# Altium project STB_LightBoard.PrjPcb (part 5 of 10)

## Sheet LED_String_AREM-80C0.SchDoc: STB Light Board - 850nm String
size A4; Author: flmoll; DrawnBy: flmoll; Organization: PBL; Revision: A; SheetNumber: 14; SheetTotal: 20
Used 12 times, as channels LIR2/IR850_10, LIR2/IR850_11, LIR2/IR850_12, LIR2/IR850_13, LIR2/IR850_14, LIR2/IR850_15, LIR2/IR850_20, LIR2/IR850_21, LIR2/IR850_22, LIR2/IR850_23, LIR2/IR850_24, LIR2/IR850_25. Parts and nets are listed once, with the designators drawn on the sheet.
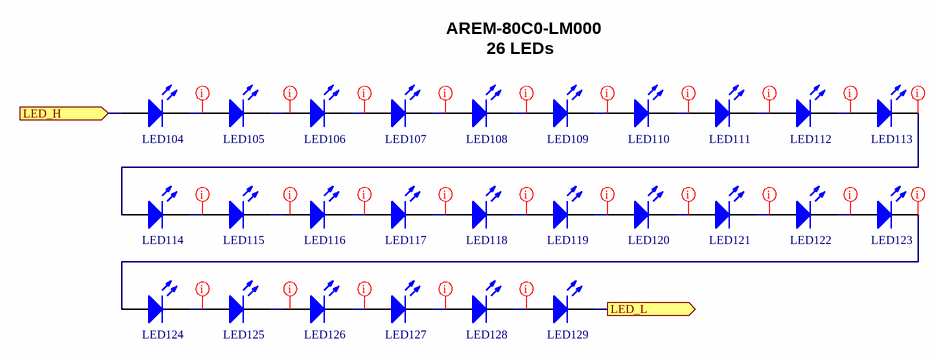
[diagram p9: LED_String_AREM-80C0.SchDoc]

### Parts
LED104  AREM-80C0-LM000  [AREM-80C0-LM000]  (value not drawn)
LED105  AREM-80C0-LM000  [AREM-80C0-LM000]  (value not drawn)
LED106  AREM-80C0-LM000  [AREM-80C0-LM000]  (value not drawn)
LED107  AREM-80C0-LM000  [AREM-80C0-LM000]  (value not drawn)
LED108  AREM-80C0-LM000  [AREM-80C0-LM000]  (value not drawn)
LED109  AREM-80C0-LM000  [AREM-80C0-LM000]  (value not drawn)
LED110  AREM-80C0-LM000  [AREM-80C0-LM000]  (value not drawn)
LED111  AREM-80C0-LM000  [AREM-80C0-LM000]  (value not drawn)
LED112  AREM-80C0-LM000  [AREM-80C0-LM000]  (value not drawn)
LED113  AREM-80C0-LM000  [AREM-80C0-LM000]  (value not drawn)
LED114  AREM-80C0-LM000  [AREM-80C0-LM000]  (value not drawn)
LED115  AREM-80C0-LM000  [AREM-80C0-LM000]  (value not drawn)
LED116  AREM-80C0-LM000  [AREM-80C0-LM000]  (value not drawn)
LED117  AREM-80C0-LM000  [AREM-80C0-LM000]  (value not drawn)
LED118  AREM-80C0-LM000  [AREM-80C0-LM000]  (value not drawn)
LED119  AREM-80C0-LM000  [AREM-80C0-LM000]  (value not drawn)
LED120  AREM-80C0-LM000  [AREM-80C0-LM000]  (value not drawn)
LED121  AREM-80C0-LM000  [AREM-80C0-LM000]  (value not drawn)
LED122  AREM-80C0-LM000  [AREM-80C0-LM000]  (value not drawn)
LED123  AREM-80C0-LM000  [AREM-80C0-LM000]  (value not drawn)
LED124  AREM-80C0-LM000  [AREM-80C0-LM000]  (value not drawn)
LED125  AREM-80C0-LM000  [AREM-80C0-LM000]  (value not drawn)
LED126  AREM-80C0-LM000  [AREM-80C0-LM000]  (value not drawn)
LED127  AREM-80C0-LM000  [AREM-80C0-LM000]  (value not drawn)
LED128  AREM-80C0-LM000  [AREM-80C0-LM000]  (value not drawn)
LED129  AREM-80C0-LM000  [AREM-80C0-LM000]  (value not drawn)

### Ports
LED_H (in, see LED_Driver_AREM-80C0[2B]), LED_L (out, see LED_Driver_AREM-80C0[2B])

### Nets
LED_H: LED104.2(A) ; port LED_H
LED_L: LED129.1(K) ; port LED_L
NetLED104_1: LED104.1(K) LED105.2(A)
NetLED105_1: LED105.1(K) LED106.2(A)
NetLED106_1: LED106.1(K) LED107.2(A)
NetLED107_1: LED107.1(K) LED108.2(A)
NetLED108_1: LED108.1(K) LED109.2(A)
NetLED109_1: LED109.1(K) LED110.2(A)
NetLED110_1: LED110.1(K) LED111.2(A)
NetLED111_1: LED111.1(K) LED112.2(A)
NetLED112_1: LED112.1(K) LED113.2(A)
NetLED113_1: LED113.1(K) LED114.2(A)
NetLED114_1: LED114.1(K) LED115.2(A)
NetLED115_1: LED115.1(K) LED116.2(A)
NetLED116_1: LED116.1(K) LED117.2(A)
NetLED117_1: LED117.1(K) LED118.2(A)
NetLED118_1: LED118.1(K) LED119.2(A)
NetLED119_1: LED119.1(K) LED120.2(A)
NetLED120_1: LED120.1(K) LED121.2(A)
NetLED121_1: LED121.1(K) LED122.2(A)
NetLED122_1: LED122.1(K) LED123.2(A)
NetLED123_1: LED123.1(K) LED124.2(A)
NetLED124_1: LED124.1(K) LED125.2(A)
NetLED125_1: LED125.1(K) LED126.2(A)
NetLED126_1: LED126.1(K) LED127.2(A)
NetLED127_1: LED127.1(K) LED128.2(A)
NetLED128_1: LED128.1(K) LED129.2(A)

### Channels
LIR2/IR850_10: designators end in _IR850_10; ports LED_H=NetC7_D19_2 LED_L=NetLED129_IR850_10_1
LIR2/IR850_11: designators end in _IR850_11; ports LED_H=NetC7_D19_2 LED_L=NetLED129_IR850_11_1
LIR2/IR850_12: designators end in _IR850_12; ports LED_H=NetC7_D19_2 LED_L=NetLED129_IR850_12_1
LIR2/IR850_13: designators end in _IR850_13; ports LED_H=NetC7_D19_2 LED_L=NetLED129_IR850_13_1
LIR2/IR850_14: designators end in _IR850_14; ports LED_H=NetC7_D19_2 LED_L=NetLED129_IR850_14_1
LIR2/IR850_15: designators end in _IR850_15; ports LED_H=NetC7_D19_2 LED_L=NetLED129_IR850_15_1
LIR2/IR850_20: designators end in _IR850_20; ports LED_H=NetC7_D20_2 LED_L=NetLED129_IR850_20_1
LIR2/IR850_21: designators end in _IR850_21; ports LED_H=NetC7_D20_2 LED_L=NetLED129_IR850_21_1
LIR2/IR850_22: designators end in _IR850_22; ports LED_H=NetC7_D20_2 LED_L=NetLED129_IR850_22_1
LIR2/IR850_23: designators end in _IR850_23; ports LED_H=NetC7_D20_2 LED_L=NetLED129_IR850_23_1
LIR2/IR850_24: designators end in _IR850_24; ports LED_H=NetC7_D20_2 LED_L=NetLED129_IR850_24_1
LIR2/IR850_25: designators end in _IR850_25; ports LED_H=NetC7_D20_2 LED_L=NetLED129_IR850_25_1

### Layout directives
net class LED: (no net found under the mark), NetLED104_IR850_10_1, NetLED106_IR850_10_1, NetLED107_IR850_10_1, NetLED108_IR850_10_1, NetLED109_IR850_10_1, NetLED110_IR850_10_1, NetLED111_IR850_10_1, NetLED112_IR850_10_1, NetLED113_IR850_10_1, NetLED114_IR850_10_1, NetLED116_IR850_10_1, NetLED117_IR850_10_1, NetLED118_IR850_10_1, NetLED119_IR850_10_1, NetLED120_IR850_10_1, NetLED121_IR850_10_1, NetLED122_IR850_10_1, NetLED123_IR850_10_1, NetLED124_IR850_10_1, NetLED126_IR850_10_1, NetLED127_IR850_10_1, NetLED128_IR850_10_1

### Notes on the sheet
- AREM-80C0-LM000
- 26 LEDs
- 1
- 2
- 3
- 4
- A
- B
- C
- Project:
- D
- Date:
- Drawing number:
- Rev:
- Format:
- A4 Q
- Drawn by:
- Laboratory:
- Page
- Sheet:
- of
- File:

### Library data of the parts
LED104-LED129 = CMP-02056-1: Infrared (IR) Emitter 850nm 1.5V 70mA 14.4mW/sr @ 70mA (Typ) 120° 2-PLCC; Mfr: Broadcom Limited; Manufacturer: Broadcom; Base Product Number: AREM; Series: AREM-80C0-xx000; Type: Infrared (IR); Current - DC Forward (If) (Max): 70mA; Radiant Intensity (Ie) Min @ If: 14.4mW/sr @ 70mA (Typ); Wavelength: 850nm; Voltage - Forward (Vf) (Typ): 1.5V; Viewing Angle: 120°; Orientation: Top View; Operating Temperature: -40°C ~ 100°C; Mounting Type: Surface Mount; Package / Case: 2-PLCC; Supplier 1: Digi-Key; Supplier Part Number 1: 516-AREM-80C0-LM000DKR-ND; Manufacturer Part Number: AREM-80C0-LM000; RoHS: No; Stock 1: 49823; Pricing 1: 1=0.62000, 10=0.40500, 100=0.26800, 1000=0.20689 (USD)

## Sheet LED_Driver_AREM-90C0.SchDoc: STB Light Board - 940nm
size A3; Author: mayerph; DrawnBy: mayerph; Organization: PBL; Revision: A; SheetNumber: 15; SheetTotal: 20
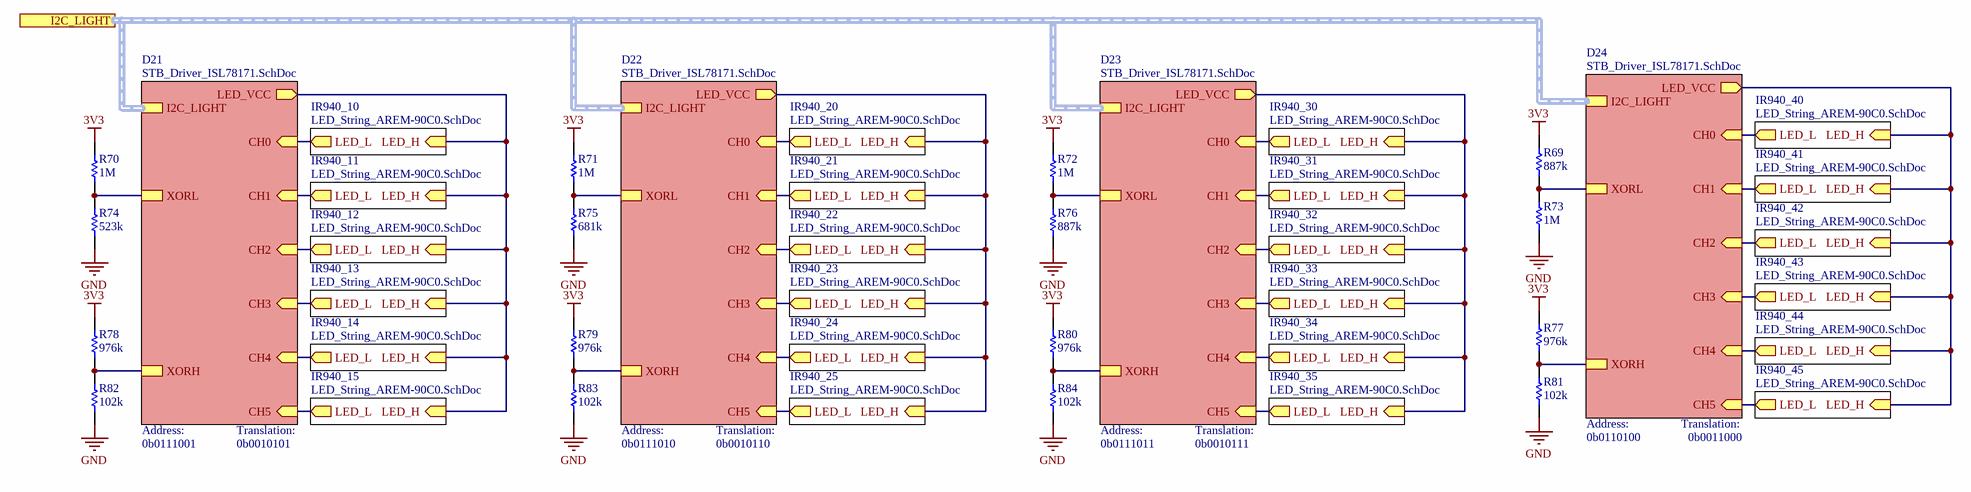
[diagram p10: LED_Driver_AREM-90C0.SchDoc]

### Parts
R69  887k  [RESC1005X40X25LL05T10]
R70  1M  [RESC1005X40X25LL05T05]
R71  1M  [RESC1005X40X25LL05T05]
R72  1M  [RESC1005X40X25LL05T05]
R73  1M  [RESC1005X40X25LL05T05]
R74  523k  [RESC1005X40X25LL05T05]
R75  681k  [RESC1005X40X25LL05T05]
R76  887k  [RESC1005X40X25LL05T10]
R77  976k  [RESC1005X40X25LL05T05]
R78  976k  [RESC1005X40X25LL05T05]
R79  976k  [RESC1005X40X25LL05T05]
R80  976k  [RESC1005X40X25LL05T05]
R81  102k  [RESC1005X40X25LL05T05]
R82  102k  [RESC1005X40X25LL05T05]
R83  102k  [RESC1005X40X25LL05T05]
R84  102k  [RESC1005X40X25LL05T05]

### Sub-sheets
D21 = STB_Driver_ISL78171.SchDoc: CH0 (in), XORL, XORH, LED_VCC (out), CH1 (in), CH2 (in), CH3 (in), CH4 (in), CH5 (in), I2C_LIGHT (harness I2C_LIGHT)
D22 = STB_Driver_ISL78171.SchDoc: CH0 (in), XORL, XORH, LED_VCC (out), CH1 (in), CH2 (in), CH3 (in), CH4 (in), CH5 (in), I2C_LIGHT (harness I2C_LIGHT)
D23 = STB_Driver_ISL78171.SchDoc: CH0 (in), XORL, XORH, LED_VCC (out), CH1 (in), CH2 (in), CH3 (in), CH4 (in), CH5 (in), I2C_LIGHT (harness I2C_LIGHT)
D24 = STB_Driver_ISL78171.SchDoc: CH0 (in), XORL, XORH, LED_VCC (out), CH1 (in), CH2 (in), CH3 (in), CH4 (in), CH5 (in), I2C_LIGHT (harness I2C_LIGHT)
IR940_10 = LED_String_AREM-90C0.SchDoc: LED_H (in), LED_L (out)
IR940_11 = LED_String_AREM-90C0.SchDoc: LED_H (in), LED_L (out)
IR940_12 = LED_String_AREM-90C0.SchDoc: LED_H (in), LED_L (out)
IR940_13 = LED_String_AREM-90C0.SchDoc: LED_H (in), LED_L (out)
IR940_14 = LED_String_AREM-90C0.SchDoc: LED_H (in), LED_L (out)
IR940_15 = LED_String_AREM-90C0.SchDoc: LED_H (in), LED_L (out)
IR940_20 = LED_String_AREM-90C0.SchDoc: LED_H (in), LED_L (out)
IR940_21 = LED_String_AREM-90C0.SchDoc: LED_H (in), LED_L (out)
IR940_22 = LED_String_AREM-90C0.SchDoc: LED_H (in), LED_L (out)
IR940_23 = LED_String_AREM-90C0.SchDoc: LED_H (in), LED_L (out)
IR940_24 = LED_String_AREM-90C0.SchDoc: LED_H (in), LED_L (out)
IR940_25 = LED_String_AREM-90C0.SchDoc: LED_H (in), LED_L (out)
IR940_30 = LED_String_AREM-90C0.SchDoc: LED_H (in), LED_L (out)
IR940_31 = LED_String_AREM-90C0.SchDoc: LED_H (in), LED_L (out)
IR940_32 = LED_String_AREM-90C0.SchDoc: LED_H (in), LED_L (out)
IR940_33 = LED_String_AREM-90C0.SchDoc: LED_H (in), LED_L (out)
IR940_34 = LED_String_AREM-90C0.SchDoc: LED_H (in), LED_L (out)
IR940_35 = LED_String_AREM-90C0.SchDoc: LED_H (in), LED_L (out)
IR940_40 = LED_String_AREM-90C0.SchDoc: LED_H (in), LED_L (out)
IR940_41 = LED_String_AREM-90C0.SchDoc: LED_H (in), LED_L (out)
IR940_42 = LED_String_AREM-90C0.SchDoc: LED_H (in), LED_L (out)
IR940_43 = LED_String_AREM-90C0.SchDoc: LED_H (in), LED_L (out)
IR940_44 = LED_String_AREM-90C0.SchDoc: LED_H (in), LED_L (out)
IR940_45 = LED_String_AREM-90C0.SchDoc: LED_H (in), LED_L (out)

### Ports
I2C_LIGHT (harness I2C_LIGHT, see STB_LightBoard[4C], LED_Driver_AREM-80C0[1A], LED_Driver_NE2B757GT[2B], LED_Driver_NE2G757GT[2B], LED_Driver_NE2R757GT-P6[2B], LED_Driver_NF2L757GT-F1[1A], LED_Driver_NF2W757GT-F1[1A], LED_Driver_QBHP686[1A], STB_Driver_ISL78171[1A], STB_FanControl[1A], STB_UID[1A])

### Nets
3V3: R69.2 R70.2 R71.2 R72.2 R77.2 R78.2 R79.2 R80.2
GND: R73.1 R74.1 R75.1 R76.1 R81.1 R82.1 R83.1 R84.1
NetC7_D21_2: sheet D21/LED_VCC, sheet IR940_10/LED_H, sheet IR940_11/LED_H, sheet IR940_12/LED_H, sheet IR940_13/LED_H, sheet IR940_14/LED_H, sheet IR940_15/LED_H
NetC7_D22_2: sheet D22/LED_VCC, sheet IR940_20/LED_H, sheet IR940_21/LED_H, sheet IR940_22/LED_H, sheet IR940_23/LED_H, sheet IR940_24/LED_H, sheet IR940_25/LED_H
NetC7_D23_2: sheet D23/LED_VCC, sheet IR940_30/LED_H, sheet IR940_31/LED_H, sheet IR940_32/LED_H, sheet IR940_33/LED_H, sheet IR940_34/LED_H, sheet IR940_35/LED_H
NetC7_D24_2: sheet D24/LED_VCC, sheet IR940_40/LED_H, sheet IR940_41/LED_H, sheet IR940_42/LED_H, sheet IR940_43/LED_H, sheet IR940_44/LED_H, sheet IR940_45/LED_H
NetLED41_IR940_10_1: sheet D21/CH0, sheet IR940_10/LED_L
NetLED41_IR940_11_1: sheet D21/CH1, sheet IR940_11/LED_L
NetLED41_IR940_12_1: sheet D21/CH2, sheet IR940_12/LED_L
NetLED41_IR940_13_1: sheet D21/CH3, sheet IR940_13/LED_L
NetLED41_IR940_14_1: sheet D21/CH4, sheet IR940_14/LED_L
NetLED41_IR940_15_1: sheet D21/CH5, sheet IR940_15/LED_L
NetLED41_IR940_20_1: sheet D22/CH0, sheet IR940_20/LED_L
NetLED41_IR940_21_1: sheet D22/CH1, sheet IR940_21/LED_L
NetLED41_IR940_22_1: sheet D22/CH2, sheet IR940_22/LED_L
NetLED41_IR940_23_1: sheet D22/CH3, sheet IR940_23/LED_L
NetLED41_IR940_24_1: sheet D22/CH4, sheet IR940_24/LED_L
NetLED41_IR940_25_1: sheet D22/CH5, sheet IR940_25/LED_L
NetLED41_IR940_30_1: sheet D23/CH0, sheet IR940_30/LED_L
NetLED41_IR940_31_1: sheet D23/CH1, sheet IR940_31/LED_L
NetLED41_IR940_32_1: sheet D23/CH2, sheet IR940_32/LED_L
NetLED41_IR940_33_1: sheet D23/CH3, sheet IR940_33/LED_L
NetLED41_IR940_34_1: sheet D23/CH4, sheet IR940_34/LED_L
NetLED41_IR940_35_1: sheet D23/CH5, sheet IR940_35/LED_L
NetLED41_IR940_40_1: sheet D24/CH0, sheet IR940_40/LED_L
NetLED41_IR940_41_1: sheet D24/CH1, sheet IR940_41/LED_L
NetLED41_IR940_42_1: sheet D24/CH2, sheet IR940_42/LED_L
NetLED41_IR940_43_1: sheet D24/CH3, sheet IR940_43/LED_L
NetLED41_IR940_44_1: sheet D24/CH4, sheet IR940_44/LED_L
NetLED41_IR940_45_1: sheet D24/CH5, sheet IR940_45/LED_L
NetR69_1: R69.1 R73.2 ; sheet D24/XORL
NetR70_1: R70.1 R74.2 ; sheet D21/XORL
NetR71_1: R71.1 R75.2 ; sheet D22/XORL
NetR72_1: R72.1 R76.2 ; sheet D23/XORL
NetR77_1: R77.1 R81.2 ; sheet D24/XORH
NetR78_1: R78.1 R82.2 ; sheet D21/XORH
NetR79_1: R79.1 R83.2 ; sheet D22/XORH
NetR80_1: R80.1 R84.2 ; sheet D23/XORH

### Buses and harness runs
harness port I2C_LIGHT = sheet D21/I2C_LIGHT = sheet D22/I2C_LIGHT = sheet D23/I2C_LIGHT = sheet D24/I2C_LIGHT

### Notes on the sheet
- (near R82) Address:
- 0b0111001
- Translation:
- 0b0010101
- (near R83) Address:
- 0b0111010
- 0b0010110
- (near R84) Address:
- 0b0111011
- 0b0010111
- (near R81) Address:
- 0b0110100
- 0b0011000
- 1
- 2
- 3
- 4
- 5
- 6
- 7
- 8
- A
- B
- C
- D
- Project:
- Date:
- Drawing number:
- Rev:
- Format:
- A3
- Drawn by:
- Laboratory:
- Page
- Sheet:
- of
- File:

### Library data of the parts
R69 R76 = CMP-2002-07827-1: Part Number: RC0402FR-07887KL; Manufacturer: Yageo / Phycomp; Tolerance: 1%; Rated Power Dissipation (P): 62.5mW; Rated Temperature: 70°C; Value: 887 kOhm; Temperature Coefficient: 100ppm/°C; Working Voltage: 50V; Additional Feature: LASER TRIMMABLE; Package Height: 0.35mm; Package Length: 1mm; Package Width: 0.5mm; Supplier 1: Digi-Key; Supplier Part Number 1: YAG3251CT-ND; Manufacturer Part Number: RC0402FR-07887KL; RoHS: Yes; Category: Chip SMD Resistors; Stock 1: 288491; Pricing 1: 1=0.10000, 10=0.01500, 100=0.00600, 1000=0.00267, 2500=0.00232, 5000=0.00192 (USD); Mount: Surface Mount; Number of Pins: 2; Size Code: 0402; Terminal Finish: Nickel; Package Shape: Rectangular; Min Operating Temperature: -55°C; Max Operating Temperature: 155°C; Resistor Type: FIXED RESISTOR; Construction: Chip; Package Style: SMTMeter; Packaging: Tape and Reel; Termination: Wraparound; JESD-609 Code: e3; Technology: METAL GLAZE/THICK FILM; Reach SVHC Compliant: Yes; RoHS Compliant: Yes; ComponentLink1URL: https://datasheet.ciiva.com:443/pdfs/VipMasterIC/IC/YAGO/YAGO-S-A0008145938/YAGO-S-A0008145938-1.pdf?src-supplier=IHS+Markit; ComponentLink1Description: https://datasheet.ciiva.com:443/pdfs/VipMasterIC/IC/YAGO/YAGO-S-A0008145938/YAGO-S-A0008145938-1.pdf?src-supplier=IHS+Markit; ComponentLink2URL: https://datasheet.ciiva.com/16744/pyu-rc0402-51-rohs-l-6-r-16744239.pdf?src-supplier=Future+Electronics; ComponentLink2Description: https://datasheet.ciiva.com/16744/pyu-rc0402-51-rohs-l-6-r-16744239.pdf?src-supplier=Future+Electronics
R70-R73 = CMP-2002-00609-3: Chip Resistor, 1 MOhm, +/- 1%, 100 mW, -55 to 155 degC, 0402 (1005 Metric), RoHS, Tape and Reel; PartNumber: ERJ-2RKF1004X; Manufacturer: Basic Passives; Voltage Rating: 50 V; Case\/Package: 0402; Value: 1 MOhm; Power Rating: 100 mW; Rated Power Dissipation (P): 100mW; Temperature Coefficient: 100ppm/°C; Working Voltage: 50V; Rated Temperature: 70°C; Package Height: 0.35mm; Package Length: 1mm; Package Width: 0.5mm; Reference Standard: AEC-Q200; Pins: 2; Max Operating Temperature: 155 degC; ComponentLink2URL: http://industrial.panasonic.com/cdbs/www-data/pdf/RDA0000/AOA0000C86.pdf; Weight: 2.8E-05oz; ComponentLink1URL: http://www.panasonic.com/; Radiation Hardening: No; Height: 0.35 mm; Case Code (Imperial): 0402; ComponentLink2Description: Datasheet; Mount: Surface Mount; ComponentLink1Description: Manufacturer URL; REACH SVHC: Yes; Length: 1 mm; Min Operating Temperature: -55 degC; Width: 0.5 mm; Package Quantity: 10000; Tolerance: 1%; PackageDescription: 2-Pin Surface Mount Device, Body 1 x 0.5 mm; RoHSCompliant: true; DatasheetVersion: 04/2015; PackageReference: 0402; Mounting Technology: Surface Mount; Case Code (Metric): 1005; Packaging: Tape and Reel; Supplier 1: Digi-Key; Supplier Part Number 1: P1.00MLDKR-ND; Manufacturer Part Number: ERJ-2RKF1004X; RoHS: Yes; Category: Chip SMD Resistors; Stock 1: 1012879; Pricing 1: 1=0.10000, 10=0.03300, 100=0.01330, 1000=0.00599, 2500=0.00520, 5000=0.00429 (USD); Number of Pins: 2; Package Shape: Rectangular; Size Code: 0402; Terminal Finish: Nickel; JESD-609 Code: e3; Resistor Type: FIXED RESISTOR; Construction: Rectangular; Package Style: SMTMeter; Technology: METAL GLAZE/THICK FILM; Termination: Wraparound; Reach SVHC Compliant: Yes; RoHS Compliant: Yes; ComponentLink3URL: https://datasheet.ciiva.com:443/pdfs/VipMasterIC/IC/PANA/PANA-S-A0009889626/PANA-S-A0009889626-1.pdf?src-supplier=IHS+Markit; ComponentLink3Description: https://datasheet.ciiva.com:443/pdfs/VipMasterIC/IC/PANA/PANA-S-A0009889626/PANA-S-A0009889626-1.pdf?src-supplier=IHS+Markit; ComponentLink4URL: https://datasheet.ciiva.com/34303/1987046-34303551.pdf?src-supplier=Jameco; ComponentLink4Description: https://datasheet.ciiva.com/34303/1987046-34303551.pdf?src-supplier=Jameco; ComponentLink5URL: https://datasheet.ciiva.com/11821/0900766b80f80784-11821229.pdf?src-supplier=RSComponents; ComponentLink5Description: https://datasheet.ciiva.com/11821/0900766b80f80784-11821229.pdf?src-supplier=RSComponents; ComponentLink6URL: https://datasheet.ciiva.com/7909/aoa0000ce2-7909180.pdf?src-supplier=Element14; ComponentLink6Description: https://datasheet.ciiva.com/7909/aoa0000ce2-7909180.pdf?src-supplier=Element14; ComponentLink7URL: https://datasheet.ciiva.com/22723/1678782-22723164.pdf?src-supplier=Element14; ComponentLink7Description: https://datasheet.ciiva.com/22723/1678782-22723164.pdf?src-supplier=Element14; ComponentLink8URL: https://datasheet.ciiva.com/24158/aoa0000ce2-24158990.pdf?src-supplier=Mouser; ComponentLink8Description: https://datasheet.ciiva.com/24158/aoa0000ce2-24158990.pdf?src-supplier=Mouser; ComponentLink9URL: https://datasheet.ciiva.com/16766/70260748-16766711.pdf?src-supplier=Allied+Electronics; ComponentLink9Description: https://datasheet.ciiva.com/16766/70260748-16766711.pdf?src-supplier=Allied+Electronics; ComponentLink10URL: https://datasheet.ciiva.com/16779/70260748-16779288.pdf?src-supplier=Allied+Electronics; ComponentLink10Description: https://datasheet.ciiva.com/16779/70260748-16779288.pdf?src-supplier=Allied+Electronics; ComponentLink11URL: https://datasheet.ciiva.com/16199/aoa0000ce2-16199544.pdf?src-supplier=Future+Electronics; ComponentLink11Description: https://datasheet.ciiva.com/16199/aoa0000ce2-16199544.pdf?src-supplier=Future+Electronics
R74 = CMP-2002-00982-1: Manufacturer: Panasonic; Part Number: ERJ-2RKF5233X; Tolerance: 1%; Rated Power Dissipation (P): 100mW; Value: 523 kOhm; Temperature Coefficient: 100ppm/°C; Working Voltage: 50V; Rated Temperature: 70°C; Package Height: 0.35mm; Package Length: 1mm; Package Width: 0.5mm; Reference Standard: AEC-Q200; Supplier 1: Digi-Key; Supplier Part Number 1: P523KLCT-ND; Manufacturer Part Number: ERJ-2RKF5233X; RoHS: Yes; Category: Chip SMD Resistors; Stock 1: 154886; Pricing 1: 1=0.10000, 10=0.03300, 100=0.01330, 1000=0.00599, 2500=0.00520, 5000=0.00429 (USD); Mount: Surface Mount; Number of Pins: 2; Size Code: 0402; Terminal Finish: Nickel; Package Shape: Rectangular; Min Operating Temperature: -55°C; Max Operating Temperature: 155°C; JESD-609 Code: e3; Resistor Type: FIXED RESISTOR; Construction: Rectangular; Package Style: SMTMeter; Packaging: Tape and Reel; Technology: METAL GLAZE/THICK FILM; Termination: Wraparound; Reach SVHC Compliant: Yes; RoHS Compliant: Yes; ComponentLink1URL: https://datasheet.ciiva.com:443/pdfs/VipMasterIC/IC/PANA/PANA-S-A0009889626/PANA-S-A0009889626-1.pdf?src-supplier=IHS+Markit; ComponentLink1Description: https://datasheet.ciiva.com:443/pdfs/VipMasterIC/IC/PANA/PANA-S-A0009889626/PANA-S-A0009889626-1.pdf?src-supplier=IHS+Markit; ComponentLink2URL: https://datasheet.ciiva.com/30220/aoa0000ce2-30220984.pdf?src-supplier=Onlinecomponents.com; ComponentLink2Description: https://datasheet.ciiva.com/30220/aoa0000ce2-30220984.pdf?src-supplier=Onlinecomponents.com; ComponentLink3URL: https://datasheet.ciiva.com/24027/aoa0000ce2-24027141.pdf?src-supplier=Mouser; ComponentLink3Description: https://datasheet.ciiva.com/24027/aoa0000ce2-24027141.pdf?src-supplier=Mouser; ComponentLink4URL: https://datasheet.ciiva.com/9181/aoa0000ce2-9181337.pdf?src-supplier=Avnet; ComponentLink4Description: https://datasheet.ciiva.com/9181/aoa0000ce2-9181337.pdf?src-supplier=Avnet; ComponentLink5URL: https://datasheet.ciiva.com/9181/aoa0000ce2-9181340.pdf?src-supplier=Avnet; ComponentLink5Description: https://datasheet.ciiva.com/9181/aoa0000ce2-9181340.pdf?src-supplier=Avnet; ComponentLink6URL: https://datasheet.ciiva.com/22668/1678782-22668381.pdf?src-supplier=Element14; ComponentLink6Description: https://datasheet.ciiva.com/22668/1678782-22668381.pdf?src-supplier=Element14; ComponentLink7URL: https://datasheet.ciiva.com/43467/1678782-43467550.pdf?src-supplier=Farnell; ComponentLink7Description: https://datasheet.ciiva.com/43467/1678782-43467550.pdf?src-supplier=Farnell; ComponentLink8URL: https://datasheet.ciiva.com/46372/1678782-46372943.pdf?src-supplier=Element14; ComponentLink8Description: https://datasheet.ciiva.com/46372/1678782-46372943.pdf?src-supplier=Element14
R75 = CMP-2002-01040-1: Manufacturer: Panasonic; Part Number: ERJ-2RKF6813X; Tolerance: 1%; Rated Power Dissipation (P): 100mW; Rated Temperature: 70°C; Value: 681 kOhm; Temperature Coefficient: 100ppm/°C; Working Voltage: 50V; Package Height: 0.35mm; Package Length: 1mm; Package Width: 0.5mm; Reference Standard: AEC-Q200; Supplier 1: Digi-Key; Supplier Part Number 1: P681KLCT-ND; Manufacturer Part Number: ERJ-2RKF6813X; RoHS: Yes; Category: Chip SMD Resistors; Stock 1: 3837; Pricing 1: 1=0.10000, 10=0.03300, 100=0.01330, 1000=0.00599, 2500=0.00520, 5000=0.00429 (USD); Mount: Surface Mount; Number of Pins: 2; Size Code: 0402; Terminal Finish: Nickel; Package Shape: Rectangular; Min Operating Temperature: -55°C; Max Operating Temperature: 155°C; Resistor Type: FIXED RESISTOR; Packaging: Tape and Reel; Termination: Wraparound; Construction: Rectangular; Package Style: SMTMeter; Technology: METAL GLAZE/THICK FILM; JESD-609 Code: e3; Reach SVHC Compliant: Yes; RoHS Compliant: Yes; ComponentLink1URL: https://datasheet.ciiva.com:443/pdfs/VipMasterIC/IC/PANA/PANA-S-A0009889626/PANA-S-A0009889626-1.pdf?src-supplier=IHS+Markit; ComponentLink1Description: https://datasheet.ciiva.com:443/pdfs/VipMasterIC/IC/PANA/PANA-S-A0009889626/PANA-S-A0009889626-1.pdf?src-supplier=IHS+Markit; ComponentLink2URL: https://datasheet.ciiva.com/3883/3984280s8821682n1386-3883650.pdf?src-supplier=Arrow+Electronics; ComponentLink2Description: https://datasheet.ciiva.com/3883/3984280s8821682n1386-3883650.pdf?src-supplier=Arrow+Electronics; ComponentLink3URL: https://datasheet.ciiva.com/16776/70260748-16776822.pdf?src-supplier=Allied+Electronics; ComponentLink3Description: https://datasheet.ciiva.com/16776/70260748-16776822.pdf?src-supplier=Allied+Electronics; ComponentLink4URL: https://datasheet.ciiva.com/9180/aoa0000ce2-9180392.pdf?src-supplier=Avnet; ComponentLink4Description: https://datasheet.ciiva.com/9180/aoa0000ce2-9180392.pdf?src-supplier=Avnet; ComponentLink5URL: https://datasheet.ciiva.com/22673/1678782-22673368.pdf?src-supplier=Element14; ComponentLink5Description: https://datasheet.ciiva.com/22673/1678782-22673368.pdf?src-supplier=Element14; ComponentLink6URL: https://datasheet.ciiva.com/7753/1678782-7753993.pdf?src-supplier=Element14; ComponentLink6Description: https://datasheet.ciiva.com/7753/1678782-7753993.pdf?src-supplier=Element14; ComponentLink7URL: https://datasheet.ciiva.com/16771/70260748-16771449.pdf?src-supplier=Allied+Electronics; ComponentLink7Description: https://datasheet.ciiva.com/16771/70260748-16771449.pdf?src-supplier=Allied+Electronics; ComponentLink8URL: https://datasheet.ciiva.com/9180/aoa0000ce2-9180348.pdf?src-supplier=Avnet; ComponentLink8Description: https://datasheet.ciiva.com/9180/aoa0000ce2-9180348.pdf?src-supplier=Avnet; ComponentLink9URL: https://datasheet.ciiva.com/43467/1678782-43467564.pdf?src-supplier=Farnell; ComponentLink9Description: https://datasheet.ciiva.com/43467/1678782-43467564.pdf?src-supplier=Farnell; ComponentLink10URL: https://datasheet.ciiva.com/24069/aoa0000ce2-24069822.pdf?src-supplier=Mouser; ComponentLink10Description: https://datasheet.ciiva.com/24069/aoa0000ce2-24069822.pdf?src-supplier=Mouser; ComponentLink11URL: https://datasheet.ciiva.com/46373/1678782-46373118.pdf?src-supplier=Element14; ComponentLink11Description: https://datasheet.ciiva.com/46373/1678782-46373118.pdf?src-supplier=Element14; ComponentLink12URL: https://datasheet.ciiva.com/30230/aoa0000ce2-30230479.pdf?src-supplier=Onlinecomponents.com; ComponentLink12Description: https://datasheet.ciiva.com/30230/aoa0000ce2-30230479.pdf?src-supplier=Onlinecomponents.com; ComponentLink13URL: https://datasheet.ciiva.com/46373/1678782-46373119.pdf?src-supplier=Element14; ComponentLink13Description: https://datasheet.ciiva.com/46373/1678782-46373119.pdf?src-supplier=Element14
R77-R80 = CMP-2002-01120-1: Manufacturer: Panasonic; Part Number: ERJ-2RKF9763X; Tolerance: 1%; Rated Power Dissipation (P): 100mW; Rated Temperature: 70°C; Value: 976 kOhm; Temperature Coefficient: 100ppm/°C; Working Voltage: 50V; Package Height: 0.35mm; Package Length: 1mm; Package Width: 0.5mm; Reference Standard: AEC-Q200; Supplier 1: Digi-Key; Supplier Part Number 1: P976KLCT-ND; Manufacturer Part Number: ERJ-2RKF9763X; RoHS: Yes; Category: Chip SMD Resistors; Stock 1: 136638; Pricing 1: 1=0.10000, 10=0.03300, 100=0.01330, 1000=0.00599, 2500=0.00520, 5000=0.00429 (USD); Mount: Surface Mount; Number of Pins: 2; Size Code: 0402; Terminal Finish: Nickel; Package Shape: Rectangular; Min Operating Temperature: -55°C; Max Operating Temperature: 155°C; Resistor Type: FIXED RESISTOR; Construction: Rectangular; Package Style: SMTMeter; Packaging: Tape and Reel; Termination: Wraparound; JESD-609 Code: e3; Technology: METAL GLAZE/THICK FILM; Reach SVHC Compliant: Yes; RoHS Compliant: Yes; ComponentLink1URL: https://datasheet.ciiva.com:443/pdfs/VipMasterIC/IC/PANA/PANA-S-A0009889626/PANA-S-A0009889626-1.pdf?src-supplier=IHS+Markit; ComponentLink1Description: https://datasheet.ciiva.com:443/pdfs/VipMasterIC/IC/PANA/PANA-S-A0009889626/PANA-S-A0009889626-1.pdf?src-supplier=IHS+Markit; ComponentLink2URL: https://datasheet.ciiva.com/43467/1678782-43467581.pdf?src-supplier=Farnell; ComponentLink2Description: https://datasheet.ciiva.com/43467/1678782-43467581.pdf?src-supplier=Farnell; ComponentLink3URL: https://datasheet.ciiva.com/46372/1678782-46372911.pdf?src-supplier=Element14; ComponentLink3Description: https://datasheet.ciiva.com/46372/1678782-46372911.pdf?src-supplier=Element14; ComponentLink4URL: https://datasheet.ciiva.com/22668/1678782-22668415.pdf?src-supplier=Element14; ComponentLink4Description: https://datasheet.ciiva.com/22668/1678782-22668415.pdf?src-supplier=Element14; ComponentLink5URL: https://datasheet.ciiva.com/16758/70260748-16758903.pdf?src-supplier=Allied+Electronics; ComponentLink5Description: https://datasheet.ciiva.com/16758/70260748-16758903.pdf?src-supplier=Allied+Electronics; ComponentLink6URL: https://datasheet.ciiva.com/9179/aoa0000ce2-9179357.pdf?src-supplier=Avnet; ComponentLink6Description: https://datasheet.ciiva.com/9179/aoa0000ce2-9179357.pdf?src-supplier=Avnet; ComponentLink7URL: https://datasheet.ciiva.com/30176/aoa0000ce2-30176831.pdf?src-supplier=Onlinecomponents.com; ComponentLink7Description: https://datasheet.ciiva.com/30176/aoa0000ce2-30176831.pdf?src-supplier=Onlinecomponents.com
R81-R84 = CMP-2002-00613-1: Manufacturer: Panasonic; Part Number: ERJ-2RKF1023X; Tolerance: 1%; Rated Power Dissipation (P): 100mW; Rated Temperature: 70°C; Value: 102 kOhm; Temperature Coefficient: 100ppm/°C; Working Voltage: 50V; Package Height: 0.35mm; Package Length: 1mm; Package Width: 0.5mm; Reference Standard: AEC-Q200; Supplier 1: Digi-Key; Supplier Part Number 1: P102KLDKR-ND; Manufacturer Part Number: ERJ-2RKF1023X; RoHS: Yes; Category: Chip SMD Resistors; Stock 1: 79400; Pricing 1: 1=0.10000, 10=0.03300, 100=0.01330, 1000=0.00599, 2500=0.00520, 5000=0.00429 (USD); Mount: Surface Mount; Number of Pins: 2; Size Code: 0402; Terminal Finish: Nickel; Package Shape: Rectangular; Min Operating Temperature: -55°C; Max Operating Temperature: 155°C; Resistor Type: FIXED RESISTOR; Construction: Rectangular; Package Style: SMTMeter; Packaging: Tape and Reel; Technology: METAL GLAZE/THICK FILM; Termination: Wraparound; JESD-609 Code: e3; Reach SVHC Compliant: Yes; RoHS Compliant: Yes; ComponentLink1URL: https://datasheet.ciiva.com:443/pdfs/VipMasterIC/IC/PANA/PANA-S-A0009889626/PANA-S-A0009889626-1.pdf?src-supplier=IHS+Markit; ComponentLink1Description: https://datasheet.ciiva.com:443/pdfs/VipMasterIC/IC/PANA/PANA-S-A0009889626/PANA-S-A0009889626-1.pdf?src-supplier=IHS+Markit; ComponentLink2URL: https://datasheet.ciiva.com/43467/1678782-43467481.pdf?src-supplier=Farnell; ComponentLink2Description: https://datasheet.ciiva.com/43467/1678782-43467481.pdf?src-supplier=Farnell; ComponentLink3URL: https://datasheet.ciiva.com/9119/aoa0000ce2-9119242.pdf?src-supplier=Avnet; ComponentLink3Description: https://datasheet.ciiva.com/9119/aoa0000ce2-9119242.pdf?src-supplier=Avnet; ComponentLink4URL: https://datasheet.ciiva.com/16781/70260748-16781503.pdf?src-supplier=Allied+Electronics; ComponentLink4Description: https://datasheet.ciiva.com/16781/70260748-16781503.pdf?src-supplier=Allied+Electronics; ComponentLink5URL: https://datasheet.ciiva.com/22673/1678782-22673487.pdf?src-supplier=Element14; ComponentLink5Description: https://datasheet.ciiva.com/22673/1678782-22673487.pdf?src-supplier=Element14; ComponentLink6URL: https://datasheet.ciiva.com/16763/70260748-16763080.pdf?src-supplier=Allied+Electronics; ComponentLink6Description: https://datasheet.ciiva.com/16763/70260748-16763080.pdf?src-supplier=Allied+Electronics; ComponentLink7URL: https://datasheet.ciiva.com/7712/1678782-7712798.pdf?src-supplier=Element14; ComponentLink7Description: https://datasheet.ciiva.com/7712/1678782-7712798.pdf?src-supplier=Element14; ComponentLink8URL: https://datasheet.ciiva.com/46373/1678782-46373215.pdf?src-supplier=Element14; ComponentLink8Description: https://datasheet.ciiva.com/46373/1678782-46373215.pdf?src-supplier=Element14

## Sheet LED_String_AREM-90C0.SchDoc: STB Light Board - 940nm String
size A4; Author: flmoll; DrawnBy: flmoll; Organization: PBL; Revision: A; SheetNumber: 16; SheetTotal: 20
Used 24 times, as channels LIR3/IR940_10, LIR3/IR940_11, LIR3/IR940_12, LIR3/IR940_13, LIR3/IR940_14, LIR3/IR940_15, LIR3/IR940_20, LIR3/IR940_21, LIR3/IR940_22, LIR3/IR940_23, LIR3/IR940_24, LIR3/IR940_25, LIR3/IR940_30, LIR3/IR940_31, LIR3/IR940_32, LIR3/IR940_33, LIR3/IR940_34, LIR3/IR940_35, LIR3/IR940_40, LIR3/IR940_41, LIR3/IR940_42, LIR3/IR940_43, LIR3/IR940_44, LIR3/IR940_45. Parts and nets are listed once, with the designators drawn on the sheet.
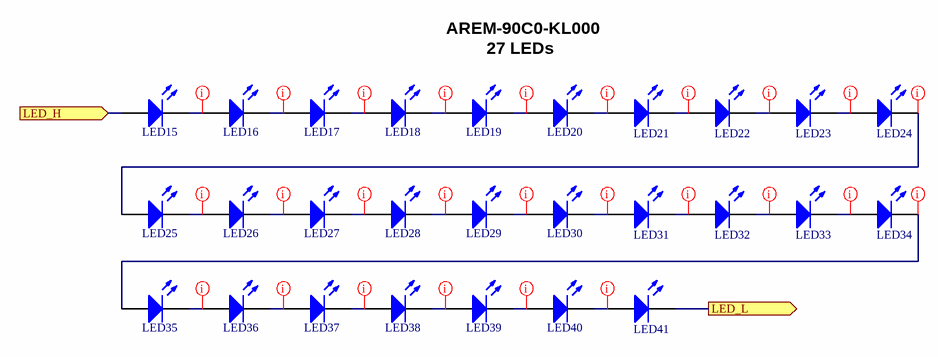
[diagram p11: LED_String_AREM-90C0.SchDoc]

### Parts
LED15  AREM-90C0-KL000  [AREM-80C0-LM000]  (value not drawn)
LED16  AREM-90C0-KL000  [AREM-80C0-LM000]  (value not drawn)
LED17  AREM-90C0-KL000  [AREM-80C0-LM000]  (value not drawn)
LED18  AREM-90C0-KL000  [AREM-80C0-LM000]  (value not drawn)
LED19  AREM-90C0-KL000  [AREM-80C0-LM000]  (value not drawn)
LED20  AREM-90C0-KL000  [AREM-80C0-LM000]  (value not drawn)
LED21  AREM-90C0-KL000  [AREM-80C0-LM000]  (value not drawn)
LED22  AREM-90C0-KL000  [AREM-80C0-LM000]  (value not drawn)
LED23  AREM-90C0-KL000  [AREM-80C0-LM000]  (value not drawn)
LED24  AREM-90C0-KL000  [AREM-80C0-LM000]  (value not drawn)
LED25  AREM-90C0-KL000  [AREM-80C0-LM000]  (value not drawn)
LED26  AREM-90C0-KL000  [AREM-80C0-LM000]  (value not drawn)
LED27  AREM-90C0-KL000  [AREM-80C0-LM000]  (value not drawn)
LED28  AREM-90C0-KL000  [AREM-80C0-LM000]  (value not drawn)
LED29  AREM-90C0-KL000  [AREM-80C0-LM000]  (value not drawn)
LED30  AREM-90C0-KL000  [AREM-80C0-LM000]  (value not drawn)
LED31  AREM-90C0-KL000  [AREM-80C0-LM000]  (value not drawn)
LED32  AREM-90C0-KL000  [AREM-80C0-LM000]  (value not drawn)
LED33  AREM-90C0-KL000  [AREM-80C0-LM000]  (value not drawn)
LED34  AREM-90C0-KL000  [AREM-80C0-LM000]  (value not drawn)
LED35  AREM-90C0-KL000  [AREM-80C0-LM000]  (value not drawn)
LED36  AREM-90C0-KL000  [AREM-80C0-LM000]  (value not drawn)
LED37  AREM-90C0-KL000  [AREM-80C0-LM000]  (value not drawn)
LED38  AREM-90C0-KL000  [AREM-80C0-LM000]  (value not drawn)
LED39  AREM-90C0-KL000  [AREM-80C0-LM000]  (value not drawn)
LED40  AREM-90C0-KL000  [AREM-80C0-LM000]  (value not drawn)
LED41  AREM-90C0-KL000  [AREM-80C0-LM000]  (value not drawn)

### Ports
LED_H (in, see LED_Driver_AREM-90C0[2A]), LED_L (out, see LED_Driver_AREM-90C0[2A])

### Nets
LED_H: LED15.2(A) ; port LED_H
LED_L: LED41.1(K) ; port LED_L
NetLED15_1: LED15.1(K) LED16.2(A)
NetLED16_1: LED16.1(K) LED17.2(A)
NetLED17_1: LED17.1(K) LED18.2(A)
NetLED18_1: LED18.1(K) LED19.2(A)
NetLED19_1: LED19.1(K) LED20.2(A)
NetLED20_1: LED20.1(K) LED21.2(A)
NetLED21_1: LED21.1(K) LED22.2(A)
NetLED22_1: LED22.1(K) LED23.2(A)
NetLED23_1: LED23.1(K) LED24.2(A)
NetLED24_1: LED24.1(K) LED25.2(A)
NetLED25_1: LED25.1(K) LED26.2(A)
NetLED26_1: LED26.1(K) LED27.2(A)
NetLED27_1: LED27.1(K) LED28.2(A)
NetLED28_1: LED28.1(K) LED29.2(A)
NetLED29_1: LED29.1(K) LED30.2(A)
NetLED30_1: LED30.1(K) LED31.2(A)
NetLED31_1: LED31.1(K) LED32.2(A)
NetLED32_1: LED32.1(K) LED33.2(A)
NetLED33_1: LED33.1(K) LED34.2(A)
NetLED34_1: LED34.1(K) LED35.2(A)
NetLED35_1: LED35.1(K) LED36.2(A)
NetLED36_1: LED36.1(K) LED37.2(A)
NetLED37_1: LED37.1(K) LED38.2(A)
NetLED38_1: LED38.1(K) LED39.2(A)
NetLED39_1: LED39.1(K) LED40.2(A)
NetLED40_1: LED40.1(K) LED41.2(A)

### Channels
LIR3/IR940_10: designators end in _IR940_10; ports LED_H=NetC7_D21_2 LED_L=NetLED41_IR940_10_1
LIR3/IR940_11: designators end in _IR940_11; ports LED_H=NetC7_D21_2 LED_L=NetLED41_IR940_11_1
LIR3/IR940_12: designators end in _IR940_12; ports LED_H=NetC7_D21_2 LED_L=NetLED41_IR940_12_1
LIR3/IR940_13: designators end in _IR940_13; ports LED_H=NetC7_D21_2 LED_L=NetLED41_IR940_13_1
LIR3/IR940_14: designators end in _IR940_14; ports LED_H=NetC7_D21_2 LED_L=NetLED41_IR940_14_1
LIR3/IR940_15: designators end in _IR940_15; ports LED_H=NetC7_D21_2 LED_L=NetLED41_IR940_15_1
LIR3/IR940_20: designators end in _IR940_20; ports LED_H=NetC7_D22_2 LED_L=NetLED41_IR940_20_1
LIR3/IR940_21: designators end in _IR940_21; ports LED_H=NetC7_D22_2 LED_L=NetLED41_IR940_21_1
LIR3/IR940_22: designators end in _IR940_22; ports LED_H=NetC7_D22_2 LED_L=NetLED41_IR940_22_1
LIR3/IR940_23: designators end in _IR940_23; ports LED_H=NetC7_D22_2 LED_L=NetLED41_IR940_23_1
LIR3/IR940_24: designators end in _IR940_24; ports LED_H=NetC7_D22_2 LED_L=NetLED41_IR940_24_1
LIR3/IR940_25: designators end in _IR940_25; ports LED_H=NetC7_D22_2 LED_L=NetLED41_IR940_25_1
LIR3/IR940_30: designators end in _IR940_30; ports LED_H=NetC7_D23_2 LED_L=NetLED41_IR940_30_1
LIR3/IR940_31: designators end in _IR940_31; ports LED_H=NetC7_D23_2 LED_L=NetLED41_IR940_31_1
LIR3/IR940_32: designators end in _IR940_32; ports LED_H=NetC7_D23_2 LED_L=NetLED41_IR940_32_1
LIR3/IR940_33: designators end in _IR940_33; ports LED_H=NetC7_D23_2 LED_L=NetLED41_IR940_33_1
LIR3/IR940_34: designators end in _IR940_34; ports LED_H=NetC7_D23_2 LED_L=NetLED41_IR940_34_1
LIR3/IR940_35: designators end in _IR940_35; ports LED_H=NetC7_D23_2 LED_L=NetLED41_IR940_35_1
LIR3/IR940_40: designators end in _IR940_40; ports LED_H=NetC7_D24_2 LED_L=NetLED41_IR940_40_1
LIR3/IR940_41: designators end in _IR940_41; ports LED_H=NetC7_D24_2 LED_L=NetLED41_IR940_41_1
LIR3/IR940_42: designators end in _IR940_42; ports LED_H=NetC7_D24_2 LED_L=NetLED41_IR940_42_1
LIR3/IR940_43: designators end in _IR940_43; ports LED_H=NetC7_D24_2 LED_L=NetLED41_IR940_43_1
LIR3/IR940_44: designators end in _IR940_44; ports LED_H=NetC7_D24_2 LED_L=NetLED41_IR940_44_1
LIR3/IR940_45: designators end in _IR940_45; ports LED_H=NetC7_D24_2 LED_L=NetLED41_IR940_45_1

### Layout directives
net class LED: NetLED15_IR940_10_1, NetLED16_IR940_10_1, NetLED17_IR940_10_1, NetLED18_IR940_10_1, NetLED19_IR940_10_1, NetLED20_IR940_10_1, NetLED21_IR940_10_1, NetLED22_IR940_10_1, NetLED23_IR940_10_1, NetLED24_IR940_10_1, NetLED25_IR940_10_1, NetLED26_IR940_10_1, NetLED27_IR940_10_1, NetLED28_IR940_10_1, NetLED29_IR940_10_1, NetLED30_IR940_10_1, NetLED31_IR940_10_1, NetLED32_IR940_10_1, NetLED33_IR940_10_1, NetLED34_IR940_10_1, NetLED35_IR940_10_1, NetLED36_IR940_10_1, NetLED37_IR940_10_1, NetLED38_IR940_10_1, NetLED39_IR940_10_1, NetLED40_IR940_10_1

### Notes on the sheet
- AREM-90C0-KL000
- 27 LEDs
- 1
- 2
- 3
- 4
- A
- B
- C
- Project:
- D
- Date:
- Drawing number:
- Rev:
- Format:
- A4 Q
- Drawn by:
- Laboratory:
- Page
- Sheet:
- of
- File:

### Library data of the parts
LED15-LED41 = CMP-02057-1: Infrared (IR) Emitter 940nm 1.4V 70mA 13.4mW/sr @ 70mA (Typ) 120° 2-PLCC; Mfr: Broadcom Limited; Manufacturer: Broadcom; Base Product Number: AREM; Series: AREM-90C0-xx000; Type: Infrared (IR); Current - DC Forward (If) (Max): 70mA; Radiant Intensity (Ie) Min @ If: 13.4mW/sr @ 70mA (Typ); Wavelength: 940nm; Voltage - Forward (Vf) (Typ): 1.4V; Viewing Angle: 120°; Orientation: Top View; Operating Temperature: -40°C ~ 100°C; Mounting Type: Surface Mount; Package / Case: 2-PLCC; Supplier 1: Digi-Key; Supplier Part Number 1: 516-AREM-90C0-KL000DKR-ND; Manufacturer Part Number: AREM-90C0-KL000; RoHS: No; Category: Uncategorized; Stock 1: 47780; Pricing 1: 1=0.62000, 10=0.40500, 100=0.26800, 1000=0.20689 (USD)